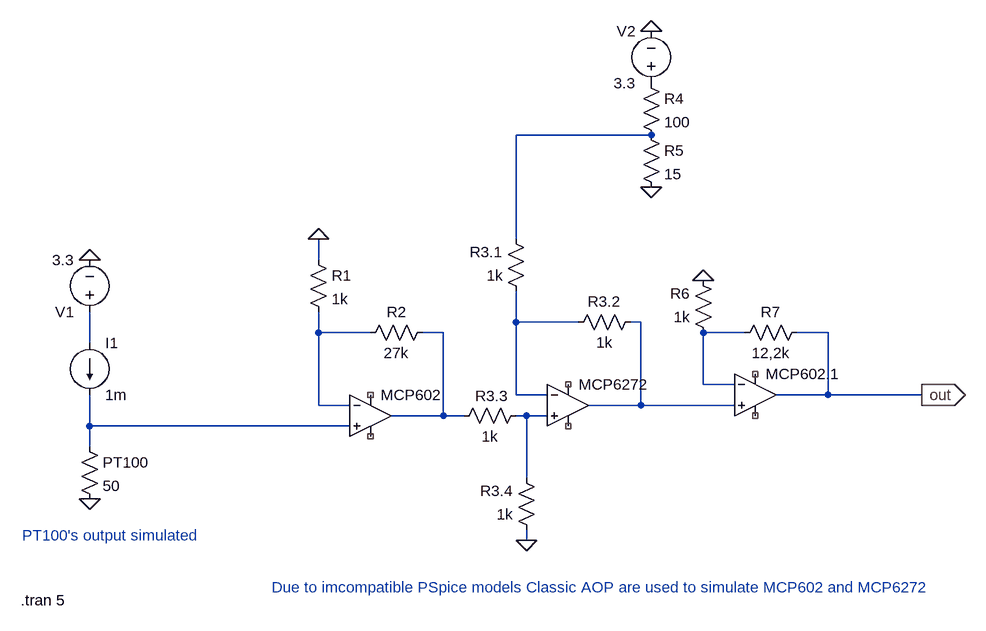
[diagram p0: schematic APP1.asc]
APP1.asc, the LTspice schematic file:
Version 4
SHEET 1 1076 700
WIRE 496 -32 288 -32
WIRE 288 128 288 -32
WIRE -16 160 -16 128
WIRE 288 256 288 208
WIRE 384 256 288 256
WIRE 480 256 464 256
WIRE -16 272 -16 240
WIRE 64 272 -16 272
WIRE 176 272 144 272
WIRE 640 272 576 272
WIRE 768 272 720 272
WIRE -368 288 -368 240
WIRE 576 352 576 272
WIRE 624 352 576 352
WIRE 288 368 288 256
WIRE 336 368 288 368
WIRE 768 368 768 272
WIRE 768 368 688 368
WIRE 912 368 768 368
WIRE -16 384 -16 272
WIRE 32 384 -16 384
WIRE 480 384 480 256
WIRE 480 384 400 384
WIRE 624 384 480 384
WIRE 176 400 176 272
WIRE 176 400 96 400
WIRE 208 400 176 400
WIRE 304 400 288 400
WIRE 336 400 304 400
WIRE -368 416 -368 368
WIRE 32 416 -368 416
WIRE -368 448 -368 416
WIRE 304 496 304 400
WIRE 304 592 304 576
FLAG -368 528 0
FLAG -16 128 0
FLAG 304 592 0
FLAG 496 48 0
FLAG -368 160 0
FLAG 496 -192 0
FLAG 576 192 0
FLAG 912 368 out
IOPIN 912 368 Out
SYMBOL OpAmps\\UniversalOpAmp 64 400 R0
SYMATTR InstName MCP602
SYMBOL OpAmps\\UniversalOpAmp 368 384 R0
SYMATTR InstName MCP6272
SYMBOL OpAmps\\UniversalOpAmp 656 368 R0
SYMATTR InstName MCP602.1
SYMBOL voltage -368 256 R180
WINDOW 123 0 0 Left 0
WINDOW 39 0 0 Left 0
SYMATTR InstName V1
SYMATTR Value 3.3
SYMBOL current -368 288 R0
WINDOW 123 0 0 Left 0
WINDOW 39 0 0 Left 0
SYMATTR InstName I1
SYMATTR Value 1m
SYMBOL res -384 432 R0
SYMATTR InstName PT100
SYMATTR Value 50
SYMBOL res -32 144 R0
SYMATTR InstName R1
SYMATTR Value 1k
SYMBOL res 160 256 R90
WINDOW 0 0 56 VBottom 2
WINDOW 3 32 56 VTop 2
SYMATTR InstName R2
SYMATTR Value 27k
SYMBOL res 304 384 R90
WINDOW 0 1 53 VBottom 2
WINDOW 3 32 56 VTop 2
SYMATTR InstName R3.3
SYMATTR Value 1k
SYMBOL res 304 224 R180
WINDOW 0 36 76 Left 2
WINDOW 3 36 40 Left 2
SYMATTR InstName R3.1
SYMATTR Value 1k
SYMBOL res 480 240 R90
WINDOW 0 0 56 VBottom 2
WINDOW 3 32 56 VTop 2
SYMATTR InstName R3.2
SYMATTR Value 1k
SYMBOL res 320 592 R180
WINDOW 0 36 76 Left 2
WINDOW 3 36 40 Left 2
SYMATTR InstName R3.4
SYMATTR Value 1k
SYMBOL res 480 -128 R0
SYMATTR InstName R4
SYMATTR Value 100
SYMBOL res 480 -48 R0
SYMATTR InstName R5
SYMATTR Value 15
SYMBOL voltage 496 -96 R180
WINDOW 0 24 96 Left 2
WINDOW 3 24 16 Left 2
WINDOW 123 0 0 Left 0
WINDOW 39 0 0 Left 0
SYMATTR InstName V2
SYMATTR Value 3.3
SYMBOL res 736 256 R90
WINDOW 0 0 56 VBottom 2
WINDOW 3 32 56 VTop 2
SYMATTR InstName R7
SYMATTR Value 12,2k
SYMBOL res 592 288 R180
WINDOW 0 36 76 Left 2
WINDOW 3 36 40 Left 2
SYMATTR InstName R6
SYMATTR Value 1k
TEXT -472 584 Left 2 ;PT100's output simulated
TEXT -88 664 Left 2 ;Due to imcompatible PSpice models Classic AOP are used to simulate MCP602 and MCP6272
TEXT -474 684 Left 2 !.tran 5

The netlist it stands for:
* APP1.asc
XMCP602 N009 N004 NC_01 NC_02 N005 level1 Avol=1Meg GBW=10Meg Vos=0 En=0 Enk=0 In=0 Ink=0 Rin=500Meg  ; pins In+ In- V+ V- OUT
XMCP6272 N008 N002 NC_03 NC_04 N003 level1 Avol=1Meg GBW=10Meg Vos=0 En=0 Enk=0 In=0 Ink=0 Rin=500Meg  ; pins In+ In- V+ V- OUT
XMCP602.1 N003 N006 NC_05 NC_06 out level1 Avol=1Meg GBW=10Meg Vos=0 En=0 Enk=0 In=0 Ink=0 Rin=500Meg  ; pins In+ In- V+ V- OUT
V1 N007 0 3.3
I1 N007 N009 1m
R§PT100 N009 0 50
R1 0 N004 1k
R2 N005 N004 27k
R3.3 N008 N005 1k
R3.1 N002 N001 1k
R3.2 N003 N002 1k
R3.4 0 N008 1k
R4 P001 N001 100
R5 N001 0 15
V2 P001 0 3.3
R7 out N006 12,2k
R6 N006 0 1k
* PT100's output simulated
* Due to imcompatible PSpice models Classic AOP are used to simulate MCP602 and MCP6272
.tran 5
.lib UniversalOpAmp1.lib
.backanno
.end